# EasyEDA Pro project ProProject_Tautek_ESP32S3_2024-01-15.epro, board PCB1
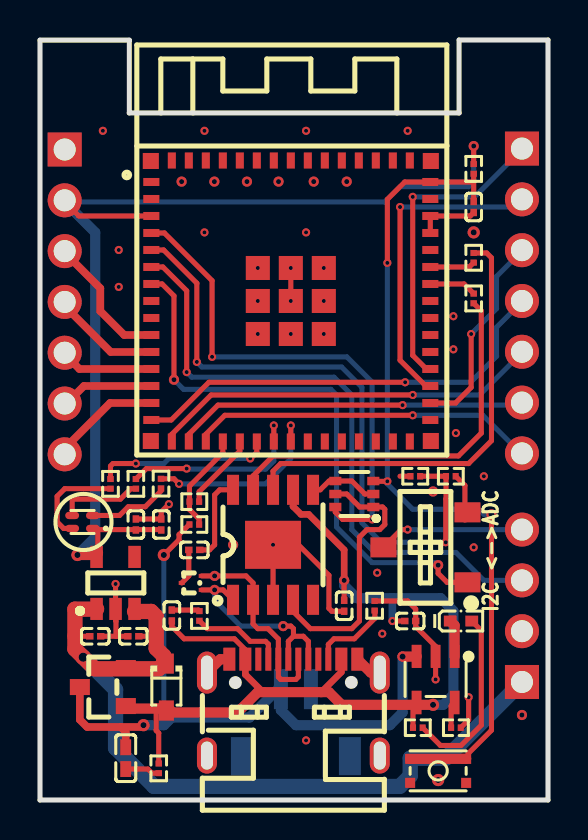
[diagram p4: board, top side]
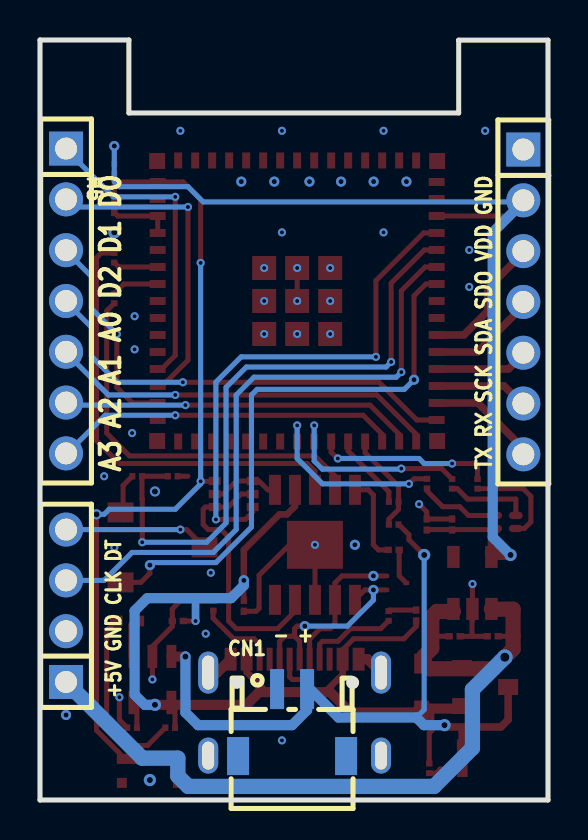
[diagram p5: board, bottom side, seen from below]

Outline 25.4 x 38 mm; copper layers: Top Layer, Bottom Layer. Coordinates in mm from the lower left corner of the outline.
Outline path: 0,0 0,37.99 4.47,37.99 4.47,34.35 20.96,34.35 20.96,38 25.4,38 25.4,0 0,0
Stack: Top Layer 0.035mm / Dielectric1 1.51mm FR4 er 4.5 / Bottom Layer 0.035mm

## Design rules (mm)
net D-: DP1
net D+: DP1
template: Custom Config
spacing copperThickness1oz (default): track to track 0.102, other pairs 0.152 to 0.3
spacing copperThickness2oz: track to track 0.203, other pairs 0.152 to 0.3
track width copperThickness1oz (default): min 0.127, default 0.254, max 2.54
track width copperThickness2oz: min 0.203, default 0.254, max 2.54
differential pair differentialPair (default): width min 0.127, default 0.254, max 2.54; gap min 0.152, default 0.152
via viaSize (default): diameter min 0.406, default 0.61, max 10; hole min 0.203, default 0.305, max 6.299

## Placement (name value [footprint] x y rotation side)
C1  100nF  [C0201]  6.59 9.22 270 top
C2  4.7uF  [C0201]  18.51 8.95 180 top
C3  10uF  [C0402]  4.29 2.09 90 top
C4  4.7uF  [C0201]  4.67 8.19 0 top
C5  100nF  [C0201]  2.76 8.19 180 top
C6  4.7uF  [C0201]  4.79 13.78 270 top
C7  100nF  [C0201]  6.06 13.78 90 top
C8  1uF  [C0201]  21.69 29.65 90 top
C9  100nF  [C0201]  7.72 12.5 180 top
C10  100nF  [C0201]  15.21 9.71 270 top
CN1  S2B-ZR-SM4A-TF(LF)(SN)  [CONN-SMD_S2B-ZR-SM4A]  12.8 3.87 180 bottom
D1  TPD2EUSB30DRTR  [SOT-9X3-3_L1.0-W0.8-P0.35-LS1.0-BR]  7.59 10.85 0 top
D2  1N5819WS  [SOD-323_L1.8-W1.3-LS2.5-RD]  6.32 5.65 270 top
H3  DZ254R-11-04-63  [HDR-TH_4P-P2.54-V-M]  24.1 9.71 90 bottom
H4  PZ254V-11-07P  [HDR-TH_7P-P2.54-V-M]  1.23 24.9 270 bottom
H5  PZ254V-11-07P  [HDR-TH_7P-P2.54-V-M]  24.1 24.95 270 bottom
LED1  16-213SDRC/S530-A3/TR8  [LED0402-RD]  21.05 8.95 0 top
LED2  FC-B1010RGBT-HG  [LED-ARRAY-SMD_4P-L1.0-W1.0-TR-RD]  2.13 13.9 270 top
Q1  AO3401A  [SOT-23_L2.9-W1.3-P1.90-LS2.4-BR]  3.14 5.65 0 top
Q2  UMH3N  [SC-70-6_L2.2-W1.3-P0.65-LS2.1-BR]  15.72 15.3 0 top
R1  5.1kΩ  [R0201]  7.97 9.2 270 top
R2  5.1kΩ  [R0201]  16.73 9.71 90 top
R3  2.2kΩ  [R0201]  18.89 3.62 180 top
R4  10kΩ  [R0201]  20.8 3.62 180 top
R5  510kΩ  [R0201]  7.72 13.78 180 top
R6  1MΩ  [R0201]  7.72 14.92 0 top
R7  100kΩ  [R0201]  5.94 1.58 90 top
R8  470Ω  [R0201]  21.69 25.08 90 top
R9  470Ω  [R0201]  21.69 27.11 270 top
R10  10kΩ  [R0201]  21.69 31.56 90 top
R11  10kΩ  [R0201]  20.54 16.19 180 top
R12  10kΩ  [R0201]  18.76 16.19 0 top
R13  2.2kΩ  [R0201]  6.05 15.82 270 top
R14  2.2kΩ  [R0201]  4.79 15.81 270 top
R15  2.2kΩ  [R0201]  3.52 15.81 270 top
SW1  CJS-1201TB  [SW-SMD_NIDEC_CJS-1201TB]  19.27 12.63 90 top
SW2  TS-1928-B  [KEY-SMD_4P-L2.8-W2.0-P1.20-LS3.0-TL]  19.91 1.46 180 top
U1  TP4054  [SOT-23-5_L3.0-W1.7-P0.95-LS2.8-BL]  19.78 6.03 180 top
U2  AP2112K-3.3TRG1  [SOT-25-5_L2.9-W1.6-P0.95-LS2.8-BL]  3.78 10.85 0 top
U3  2.4GHz  [BULETM-SMD_ESP32-S3-MINI-1-N8]  12.54 24.95 0 top
U4  CH340K  [ESOP-10_L4.9-W3.9-P1.00-LS6.2-BL-EP]  11.65 12.76 0 top
USB1  TYPEC-304-ACP16  [USB-C-SMD_TYPE-C-16P-1]  12.67 4.63 0 top

## Footprints (pads in the part's own frame, mm; a bottom-side part is the same pattern mirrored in y, then rotated)
BULETM-SMD_ESP32-S3-MINI-1-N8
  rect 0.8x0.4 smd: 1(-6.975,5.95) 2(-6.975,5.1) 3(-6.975,4.25) 4(-6.975,3.4) 5(-6.975,2.55) 6(-6.975,1.7) 7(-6.975,0.85) 8(-6.975,0) 9(-6.975,-0.85) 10(-6.975,-1.7) 11(-6.975,-2.55) 12(-6.975,-3.4) 13(-6.975,-4.25) 14(-6.975,-5.1) 15(-6.975,-5.95) 31(6.975,-5.95) 32(6.975,-5.1) 33(6.975,-4.25) 34(6.975,-3.4) 35(6.975,-2.55) 36(6.975,-1.7) 37(6.975,-0.85) 38(6.975,0) 39(6.975,0.85) 40(6.975,1.7) 41(6.975,2.55) 42(6.975,3.4) 43(6.975,4.25) 44(6.975,5.1) 45(6.975,5.95)
  rect 0.4x0.8 smd: 16(-5.95,-7.025) 17(-5.1,-7.025) 18(-4.25,-7.025) 19(-3.4,-7.025) 20(-2.55,-7.025) 21(-1.7,-7.025) 22(-0.85,-7.025) 23(0,-7.025) 24(0.85,-7.025) 25(1.7,-7.025) 26(2.55,-7.025) 27(3.4,-7.025) 28(4.25,-7.025) 29(5.1,-7.025) 30(5.95,-7.025) 46(5.95,7.025) 47(5.1,7.025) 48(4.25,7.025) 49(3.4,7.025) 50(2.55,7.025) 51(1.7,7.025) 52(0.85,7.025) 53(0,7.025) 54(-0.85,7.025) 55(-1.7,7.025) 56(-2.55,7.025) 57(-3.4,7.025) 58(-4.25,7.025) 59(-5.1,7.025) 60(-5.95,7.025)
  rect 0.8x0.8 smd: GND(-7,7) GND(-7,-7) GND(7,7) GND(7,-7)
  rect 1.2x1.2 smd: GND(-1.65,1.65) GND(-1.65,0) GND(-1.65,-1.65) GND(0,1.65) GND(0,0) GND(0,-1.65) GND(1.65,1.65) GND(1.65,0) GND(1.65,-1.65)
C0201
  rect 0.368x0.324 smd: 1(-0.275,0) 2(0.275,0)
C0402
  rect 0.79x0.54 smd: 1(-0.545,0) 2(0.545,0)
CONN-SMD_S2B-ZR-SM4A
  rect 1.1x1.9 smd: 0(-2.7,-1.675) 0(2.7,-1.675)
  rect 0.7x2 smd: 1(-0.75,1.675) 2(0.75,1.675)
ESOP-10_L4.9-W3.9-P1.00-LS6.2-BL-EP
  rect 0.6x1.5 smd: 1(-2,-2.75) 2(-1,-2.75) 3(0,-2.75) 4(1,-2.75) 5(2,-2.75) 6(2,2.75) 7(1,2.75) 8(0,2.75) 9(-1,2.75) 10(-2,2.75)
  rect 2.8x2.4 smd: 11(0,0)
HDR-TH_4P-P2.54-V-M
  rect 1.7x1.7 hole 1.1: 1(-3.81,0)
  round 1.7 hole 1.1: 2(-1.27,0) 3(1.27,0) 4(3.81,0)
HDR-TH_7P-P2.54-V-M
  rect 1.7x1.7 hole 1.1: 1(-7.62,0)
  round 1.7 hole 1.1: 2(-5.08,0) 3(-2.54,0) 4(0,0) 5(2.54,0) 6(5.08,0) 7(7.62,0)
KEY-SMD_4P-L2.8-W2.0-P1.20-LS3.0-TL
  rect 0.5x0.5 smd: 1(-1.4,0.6) 2(1.4,0.6) 3(-1.4,-0.6) 4(1.4,-0.6)
LED0402-RD
  rect 0.636x0.54 smd: 1(-0.538,0) 2(0.538,0)
LED-ARRAY-SMD_4P-L1.0-W1.0-TR-RD
  oval 0.364x0.687 smd: 1(0.325,0.518) 2(0.325,-0.518) 3(-0.325,-0.518) 4(-0.325,0.518)
R0201
  rect 0.303x0.324 smd: 1(-0.241,0) 2(0.241,0)
SC-70-6_L2.2-W1.3-P0.65-LS2.1-BR
  rect 0.6x0.42 smd: 1(0.95,-0.65) 2(0.95,0) 3(0.95,0.65) 4(-0.95,0.65) 5(-0.95,0) 6(-0.95,-0.65)
SOD-323_L1.8-W1.3-LS2.5-RD
  rect 1x0.75 smd: 1(-1.173,0) 2(1.173,0)
SOT-9X3-3_L1.0-W0.8-P0.35-LS1.0-BR
  rect 0.3x0.2 smd: 1(0.5,-0.35) 2(0.5,0.35) 3(-0.5,0)
SOT-23-5_L3.0-W1.7-P0.95-LS2.8-BL
  rect 0.49x1.157 smd: 1(-0.95,-1.153) 2(0,-1.153) 3(0.95,-1.153)
  rect 0.49x1.175 smd: 4(0.95,1.153) 5(-0.95,1.153)
SOT-23_L2.9-W1.3-P1.90-LS2.4-BR
  rect 1x0.8 smd: 1(1.15,-0.95) 2(1.15,0.95) 3(-1.15,0)
SOT-25-5_L2.9-W1.6-P0.95-LS2.8-BL
  rect 0.623x1.105 smd: 1(-0.95,-1.3) 2(-0.001,-1.3) 3(0.95,-1.3) 4(0.95,1.3) 5(-0.95,1.3)
SW-SMD_NIDEC_CJS-1201TB
  rect 1x1.3 smd: 1(-1.75,-2.1) 2(0,2.1) 3(1.75,-2.1)
USB-C-SMD_TYPE-C-16P-1
  rect 0.6x1.15 smd: A1B12(-3.2,2.41) A4B9(-2.4,2.41) B1A12(3.2,2.41) B4A9(2.4,2.41)
  rect 0.3x1.15 smd: A5(-1.25,2.41) A6(-0.25,2.41) A7(0.25,2.41) A8(1.25,2.41) B5(1.75,2.41) B6(0.75,2.41) B7(-0.75,2.41) B8(-1.75,2.41)
  oval 1x2.1 hole 0.6x1.7: EP(-4.32,1.74) EP(4.32,1.74)
  oval 1x1.8 hole 0.6x1.4: EP(-4.32,-2.41) EP(4.32,-2.41)

## Nets
As in the schematic.

Pads without a net: U2 4; U3 24 25 26 27 28 29 30 31 35 36 37 38 41 44; U4 5; USB1 A8 B8

## Via types
v1: diameter 0.406, hole 0.203, Top Layer to Bottom Layer, 52 vias
v2: diameter 0.508, hole 0.254, Top Layer to Bottom Layer, 15 vias
v3: diameter 0.61, hole 0.305, Top Layer to Bottom Layer, 6 vias
v4: diameter 0.508, hole 0.305, Top Layer to Bottom Layer, 3 vias
v5: diameter 0.762, hole 0.457, Top Layer to Bottom Layer, 1 via

## Routing (per net, layer and track width the routed paths; a pad name or vN(x,y) marks a point on that pad's centre or on a via; arc(x,y) is an arc through that point)
GND: length 35.6
  Top Layer w0.254: R2.2 18.38,9.95 18.78,9.55 C2.1 18.78,8.67 19.78,7.68 U1.2 v1(19.78,6.03) ; 3.8,8.19 C5.1 ; 3.8,8.19 3.8,8.95 3.78,8.97 U2.2 v1(3.78,10.8) ; 3.8,8.19 C4.1 ; 19.52,28.35 19.52,29.2 21.51,29.2 C8.1 ; R12.1 18,16.19 ; D1.3 7.44,11.21 C9.2 ; C3.1 5.39,1.55 5.6,1.34 R7.1 ; C1.1 7.92,9.5 R1.1 ; R4.1 21.43,4.01 v1(21.43,5.14) ; v1(6.45,14.79) 6.06,14.41 C7.2 C6.1 ; U4.3 v1(11.65,12.76) 12.92,12.76 14.45,11.23 14.45,9.58 14.59,9.44 C10.2 ; v1(12.54,26.6) v1(12.54,24.95)
  Top Layer w0.508: USB1.EP 16.54,6.37 USB1.B1A12 ; USB1.EP 9.02,7.04 USB1.A1B12
  vias: v1(3.14,33.46) v1(3.94,27.5) v1(3.94,25.65) v1(8.22,33.46) v1(8.22,28.38) v1(10.89,26.6) v1(10.89,24.95) v1(10.89,23.3) v1(12.54,23.3) v1(13.3,33.46) v1(13.3,28.38) v1(13.3,2.98) v1(14.19,26.6) v1(14.19,24.95) v1(14.19,23.3) v1(16.86,11.36) v1(17.11,8.31) v1(18.38,33.46) v1(20.67,24.19) v1(20.67,22.53) v1(20.8,18.35) v1(21.69,12.63) v1(22.19,16.19) v2(7.08,30.92) v2(8.72,30.92) v2(9.66,12.76) v2(10.35,30.92) v2(11.93,30.92) v2(13.69,30.92) v2(15.34,30.92) v2(24.1,4.25) v3(19.91,1) v3(21.69,28.38) v4(19.65,15.43)
VBUS: length 49.5
  Top Layer w0.254: v1(17.62,8.95) C2.2 ; 5.91,4.57 5.81,4.47 5.81,3.48 5.94,3.35 R7.2 ; R3.2 18.65,4.76 ; USB1.A4B9 10.25,7.05 10.25,7.52 9.72,8.06 7.21,8.06 6.59,8.67 C1.2 ; v2(15.21,10.98) C10.1
  Top Layer w0.33: v2(15.21,10.98) 15.21,12.5 13.43,14.28 13.05,14.28 12.65,14.68 U4.7 ; 11.15,5.39 10.27,6.27 USB1.A4B9 ; 14.06,5.39 15.07,6.4 USB1.B4A9
  Top Layer w0.508: v3(19.65,4.76) 15.08,4.76 14.45,5.39 10.89,5.39 9.87,4.38 6.64,4.38 6.43,4.58 6.41,4.57 4.1,4.57
  Bottom Layer w0.381: 17.59,10.09 17.62,10.06 v1(17.62,8.95)
  Bottom Layer w0.508: v2(15.21,10.98) 15.21,10.73 15.84,10.09 20.03,10.09 20.67,9.46 20.67,5.27 20.16,4.76 v3(19.65,4.76)
VCC: length 42.4
  Top Layer w0.254: C4.2 5.81,8.19 ; 1.75,8.19 C5.2
  Top Layer w0.762: 4.73,9.43 5.56,9.43 5.81,9.17 5.81,7.58 6.19,7.2 6.19,6.82 5.93,6.56 2.74,6.56 v5(2.16,7.14) 1.75,7.55 1.75,9.54 2.81,9.54 U2.1
  Bottom Layer w0.762: H3.1 20.29,2.09 18.51,2.09 18.51,1.2 17.99,0.68 5.7,0.68 3.78,2.6 3.78,5.52 v5(2.16,7.14)
VDD: length 52.8
  Top Layer w0.254: C7.1 6.04,13.52 2.89,13.52 ; v2(21.69,32.7) R10.2 ; 2.89,12.22 2.89,13.52 ; 1.24,29.9 1.94,29.2 U3.3 ; 2.89,13.52 2.59,13.52 2.52,13.45
  Top Layer w0.508: 2.9,12.35 2.8,12.25 v3(1.87,12.25)
  Bottom Layer w0.254: v2(21.69,32.7) 21.69,30.92 21.43,30.67 18,30.67 17.24,29.9 1.24,29.9
  Bottom Layer w0.508: v3(1.87,12.25) 2.76,13.14 2.76,28.38 1.24,29.9
A0: length 31.7
  Top Layer w0.254: U3.5 6.18,27.5 7.84,25.84 v1(7.84,21.9) ; R12.2 R11.2 20.3,15.06 20.29,15.05 v1(20.29,12.89)
  Bottom Layer w0.254: v1(20.29,12.89) 17.07,12.89 16.1,13.85 16.1,20.63 15.08,21.65 8.1,21.65 v1(7.84,21.9)
ADC2_0: length 21.8
  Top Layer w0.254: v1(18.26,20.89) 8.45,20.89 6.56,19 U3.15
  Bottom Layer w0.254: v1(18.26,20.89) 21.53,20.89 22.83,22.19 22.83,23.64 24.09,24.9
ADC2_1: length 19.6
  Top Layer w0.254: U3.16 6.59,18.28 8.56,20.25 v1(18.64,20.25)
  Bottom Layer w0.254: v1(18.64,20.25) 21.98,20.25 24.09,22.36
ADC2_2: length 17.7
  Top Layer w0.254: U3.17 7.44,18.28 8.9,19.74 v1(18.13,19.74)
  Bottom Layer w0.254: v1(18.13,19.74) 24.01,19.74 24.09,19.82
ADC2_3: length 17.4
  Top Layer w0.254: v1(18.64,19.24) 9.24,19.24 8.29,18.28 U3.18
  Bottom Layer w0.254: 24.09,17.28 22.14,19.24 v1(18.64,19.24)
ADC2_4: length 5
  Top Layer w0.254: R5.1 7.96,14.04 7.47,14.52 R6.1 7.47,15.69 9.14,17.36 U3.19
BAT+: length 35.5
  Top Layer w0.254: v3(6.19,12.25) 6.95,13.01 6.95,13.27 7.46,13.78 R5.2
  Top Layer w0.381: 4.03,3.65 2.35,3.65 1.99,4.01 Q1.3 ; 4.03,3.65 4.29,3.4 C3.2 ; 4.03,3.65 5.09,3.65 v3(5.18,3.74)
  Top Layer w0.508: v4(18.13,7.17) 18.82,7.17 U1.3
  Bottom Layer w0.254: 6.58,4.12 6.19,4.52 v3(6.19,12.25)
  Bottom Layer w0.508: v3(5.18,3.74) 6.2,3.74 6.58,4.12 10.47,4.12 12.05,5.69 12.05,4.49 12.8,3.74 17.49,3.74 18.13,4.38 v4(18.13,7.17)
BLUE: length 9.6
  Top Layer w0.254: R13.1 6.7,16.06 v1(6.95,15.81) ; U3.23 v1(12.54,18.73)
  Bottom Layer w0.254: v1(6.95,15.81) 11.27,15.81 12.54,17.08 v1(12.54,18.73)
CHIP_EN: length 42.1
  Top Layer w0.254: R10.1 21.69,30.9 ; 21.69,30.9 21.68,30.9 18.24,30.9 17.37,30.03 v1(17.37,26.86) ; 21.69,30.9 C8.2 ; v1(17.37,15.93) 16.76,15.93 16.75,15.95 16.67,15.95 ; 21.4,2.31 22.57,3.49 v4(22.57,14.28)
  Top Layer w0.508: SW2.3 SW2.4
  Bottom Layer w0.254: v4(22.57,14.28) 22.19,14.28 21.94,14.54 18.64,14.54 17.37,15.81 v1(17.37,15.93) v1(17.37,26.86)
CLK: length 31.3
  Top Layer w0.254: U3.6 6.14,26.65 7.33,25.46 v1(7.33,21.39)
  Bottom Layer w0.254: H3.3 22.19,10.98 20.8,12.38 16.73,12.38 15.59,13.52 15.59,20.25 14.7,21.14 7.59,21.14 v1(7.33,21.39)
D+: length 10.2
  Top Layer w0.254: USB1.B6 13.42,7.93 13.16,8.19 12.67,8.19 ; U4.1 9.16,10.5 v2(8.73,10.5) D1.1 ; 12.67,8.19 12.67,8.57 12.55,8.7 v2(12.16,8.7) ; 12.67,8.19 12.42,7.93 USB1.A6
  Bottom Layer w0.254: v2(12.16,8.7) 10.03,8.7 8.73,10 v2(8.73,10.5)
D-: length 10.2
  Top Layer w0.254: D1.2 v2(8.73,11.2) 10.3,11.2 10.65,10.85 U4.2 10.65,8.81 10.89,8.57 11.4,8.57 11.92,8.05 USB1.B7 11.92,6.14 12.03,6.03 12.79,6.03 12.92,6.16 USB1.A7
DATA: length 7.3
  Top Layer w0.254: SW1.2 18.06,13.52 v1(18.38,13.52)
  Bottom Layer w0.254: H3.4 v1(18.38,13.52)
DTR: length 13.7
  Top Layer w0.254: Q2.5 15.34,15.3 15.99,14.65 Q2.1 17.13,14.65 17.24,14.54 17.24,13.78 16.99,13.52 16.35,13.52 15.97,13.14 15.97,8.95 15.59,8.57 13.52,8.57 12.65,9.43 U4.4
GREEN: length 9.9
  Top Layer w0.254: R14.1 5.31,16.57 v1(7.33,16.57) ; U3.22 v1(11.69,18.73)
  Bottom Layer w0.254: v1(11.69,18.73) 11.69,16.95 11.28,16.54 7.36,16.54 v1(7.33,16.57)
IO0: length 25.5
  Top Layer w0.254: v1(16.61,14.03) 15.13,14.03 14.77,14.39 Q2.6 ; v1(8.6,22.16) 8.6,25.97 6.22,28.35 U3.4
  Bottom Layer w0.254: v1(16.61,14.03) 16.61,20.89 15.34,22.16 v1(8.6,22.16)
IO36: length 10.2
  Top Layer w0.254: v1(21.56,23.3) 21.56,20.63 20.78,19.85 19.52,19.85
  Bottom Layer w0.254: v1(21.56,23.3) 22.83,24.57 22.83,26.18 24.09,27.44
IO37: length 15.9
  Top Layer w0.254: v1(18,29.65) 18,21.99 19.29,20.7 19.52,20.7
  Bottom Layer w0.254: 24.09,29.98 23.76,29.65 v1(18,29.65)
IO38: length 15.5
  Top Layer w0.254: v1(18.64,30.16) 18.64,22.23 19.32,21.55 19.52,21.55
  Bottom Layer w0.254: v1(18.64,30.16) 21.73,30.16 24.09,32.52
READ_BAT: length 3.9
  Top Layer w0.254: R6.2 7.96,15.41 9.99,17.45 U3.20
RED: length 8.8
  Top Layer w0.254: U3.21 10.84,17.39 10.53,17.08 v1(10.51,17.08) ; R15.1 3.52,16.7 3.65,16.82 v1(4.79,16.82)
  Bottom Layer w0.254: v1(4.79,16.82) 6.19,16.82 6.45,17.08 v1(10.51,17.08)
RTS: length 3.5
  Top Layer w0.254: U4.6 14.01,15.51 14.45,15.95 15.59,15.95 16.24,15.3 Q2.2
RX0: length 2.3
  Top Layer w0.254: 19.52,26.65 21.47,26.65 R9.2
RXD: length 4.7
  Top Layer w0.381: 1.24,19.74 2.2,20.7 U3.13
SCK1: length 4.6
  Top Layer w0.381: 1.24,22.28 1.97,21.55 U3.12
SDA: length 28.6
  Top Layer w0.254: v2(6.7,21.01) 6.7,25.2 6.1,25.8 U3.7 ; SW1.1 20.36,10.88 19.91,11.33 v2(19.91,11.74)
  Bottom Layer w0.254: v2(19.91,11.74) 19.78,11.87 16.61,11.87 14.83,13.65 14.83,20.25 14.55,20.53 7.18,20.53 v2(6.7,21.01)
SDA1: length 5.4
  Top Layer w0.381: 1.24,24.82 1.24,24.7 3.53,22.4 5.57,22.4
SDO1: length 6.7
  Top Layer w0.381: U3.10 4.21,23.25 3.02,24.44 3.02,25.59 1.24,27.36
TX0: length 2.4
  Top Layer w0.254: 19.52,25.8 21.2,25.8 R8.2
TXD: length 5.6
  Top Layer w0.381: U3.14 3.5,19.85 1.24,17.59 1.24,17.2
$1N1876: length 4.7
  Top Layer w0.254: USB1.A5 11.42,7.79 11.28,7.93 10.51,7.93 9.87,8.57 8.36,8.57 R1.2
$1N1877: length 4
  Top Layer w0.254: R2.1 16.74,9.46 16.74,9.09 15.72,8.06 14.7,8.06 14.42,7.78 USB1.B5
$1N2402: length 1.3
  Top Layer w0.254: R4.2 20.55,4.7 U1.5
$1N2411: length 9.1
  Top Layer w0.254: LED1.2 22.07,8.47 22.07,3.74 21.05,2.73 20.02,2.73 R3.1
$1N2412: length 1.9
  Top Layer w0.508: LED1.1 20.73,8.73 U1.1
$1N4112: length 22.6
  Top Layer w0.254: U4.8 11.65,16.44 12.03,16.82 21.43,16.82 22.57,17.97 22.57,27.11 22.33,27.35 R9.1
$1N4115: length 19.6
  Top Layer w0.254: U4.9 10.65,16.2 11.65,17.2 20.92,17.2 22.07,18.35 22.07,24.46 R8.1
$1N4150: length 4.4
  Top Layer w0.254: U4.10 8.99,15.51 8.73,15.25 8.73,12.76 8.48,12.5 C9.1
$1N6523: length 2.4
  Top Layer w0.254: R11.1 21.25,15.73 21.25,14
$1N9339: length 3.9
  Top Layer w0.254: 6.05,15.45 5.26,14.66 4.41,14.66 3.98,14.23 LED2.4
$1N9340: length 4.2
  Top Layer w0.254: R14.2 4.54,15.57 4.02,15.05 1.61,15.05 LED2.3
$1N9341: length 5
  Top Layer w0.254: R15.2 1.24,15.57 0.86,15.18 0.86,13.9 1.18,13.58 LED2.2

## Copper pours and planes (outline as drawn; the poured copper is in the pictures)
GND on Top Layer: -3.46,41.33 30.96,41.33 30.96,-4.26 -3.46,-4.26
GND on Bottom Layer: -2.44,39.68 28.03,39.68 28.03,-2.35 -2.44,-2.35

## Text on the board
Bottom Silkscreen Layer: + - | +5V GND CLK DT | TX RX SCK SDA SDO VDD GND | A3 A2 A1 A0 D2 D1 D0
Top Silkscreen Layer: ADC | <-> | I2C
